# Altium project ETH_POE_SPI_RJ45.PrjPcb
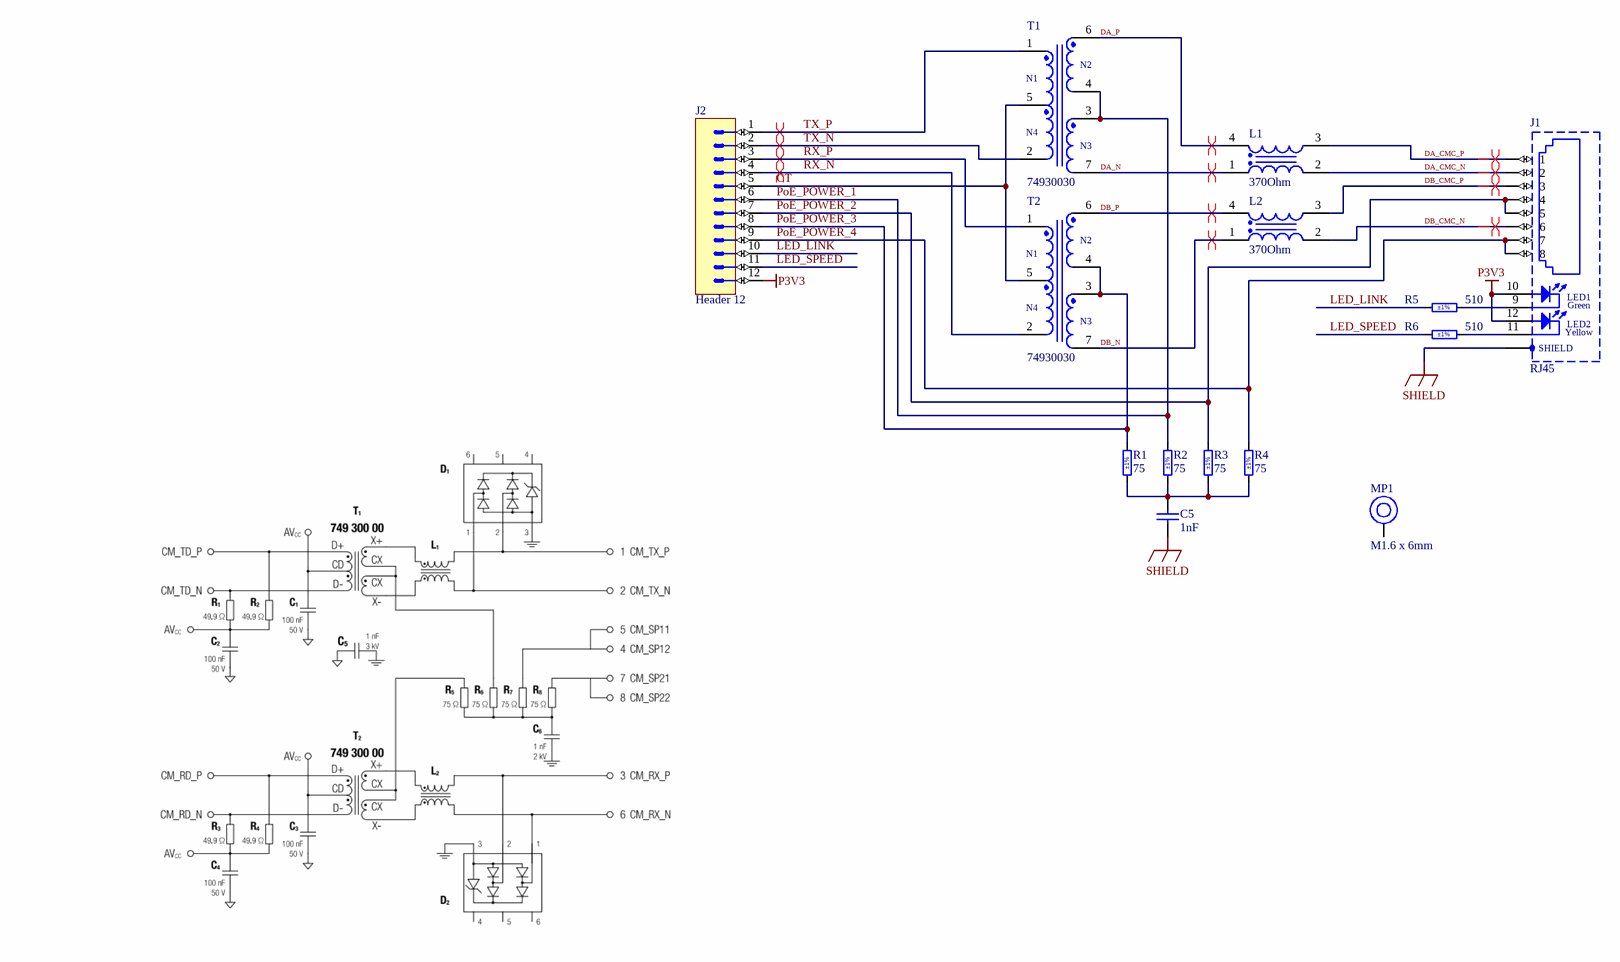
[diagram p0: ETH_POE_SPI_RJ45.SchDoc]
CreateDate: 11/12/2025; Revision: 1.0
1 sheet, 14 parts. Net scope: global (net labels, ports and power ports of the same name join across sheets).
Board file: ETH_POE_SPI_RJ45.PcbDoc

## Sheet ETH_POE_SPI_RJ45.SchDoc: ETH_POE_SPI_RJ45
size A3; Author: M.Beldyga; CompanyName: WUT ISE; DrawnBy: M.Beldyga; Organization: WUT ISE; Address1: PW ISE; Address2: Nowowiejska 15/19 00-665 Warsaw; Address3: micbeldyga@gmail.com; SheetNumber: 1; SheetTotal: 1; ModifiedBy: -; CheckedDate: -; Title2: MODULIQ; DivGrp: WUT ISE; Designer: M.Beldyga; ModifiedDate: -; ProjectName: Sensor Box

### Parts
C5  1nF  [CAPC3216X180N]
J1  RJ45  [AMPHENOL_RJHSE-3381]
J2  Header 12  [SAMTEC_HTSW-106-23-L-D]
L1  370Ohm  [WE-CNSW_0805]
L2  370Ohm  [WE-CNSW_0805]
MP1  M1.6 x 6mm  [97730606334]
R1  75  Tolerance: ±1%  [RESC1005X40N]
R2  75  Tolerance: ±1%  [RESC1005X40N]
R3  75  Tolerance: ±1%  [RESC1005X40N]
R4  75  Tolerance: ±1%  [RESC1005X40N]
R5  510  Tolerance: ±1%  [RESC1005X40N]
R6  510  Tolerance: ±1%  [RESC1005X40N]
T1  74930030  [74930030]
T2  74930030  [74930030]

### Nets
P3V3: J1.10(ALED1) J1.12(CLED2) J2.12
SHIELD: C5.1 J1.SHIELD
CT: J2.5 T1.5 T2.5
DA_CMC_N: J1.2 L1.2
DA_CMC_P: J1.1 L1.3
DA_N: L1.1 T1.7
DA_P: L1.4 T1.6
DB_CMC_N: J1.6 L2.2
DB_CMC_P: J1.3 L2.3
DB_N: L2.1 T2.7
DB_P: L2.4 T2.6
LED_LINK: J2.10 R5.1
LED_SPEED: J2.11 R6.1
PoE_POWER_1: J2.6 R2.2 T1.3 T1.4
PoE_POWER_2: J1.4 J1.5 J2.7 R3.2
PoE_POWER_3: J2.8 R1.2 T2.3 T2.4
PoE_POWER_4: J1.7 J1.8 J2.9 R4.2
RX_N: J2.4 T2.2
RX_P: J2.3 T2.1
TX_N: J2.2 T1.2
TX_P: J2.1 T1.1
NetC5_2: C5.2 R1.1 R2.1 R3.1 R4.1
NetJ1_9: J1.9(CLED1) R5.2
NetJ1_11: J1.11(ALED2) R6.2

Not connected (* = marked no-connect by the designer): MP1 1

### Layout directives
differential pair; net class D100: DA_CMC_N, DA_CMC_P, DA_N, DA_P, DB_CMC_N, DB_CMC_P, DB_N, DB_P, RX_N, RX_P, TX_N, TX_P

### Notes on the sheet
- Project/Equipment
- Document
- Designer
- Drawn by
- Check.by
- Contact
- File
- Last Mod.
- Print Date
- Sheet
- Size
- A3
- of
- Rev
- (in symbol 74930030) N2; N1; N4; N3
- (in symbol AMPHENOL_RJHSE-3381) LED1; Green; LED2; Yellow

### Library data of the parts
C5 = CC1206_1NF_2KV_10%_X7R: Non-polarised capacitor; Part Description: High Voltage MLC Chip Capacitor; Manufacturer: GENERIC; Manufacturer1 Part Number: 1206GC102KAT2A; Voltage: 2kV; TC: X7R; Tolerance: ±10%; Part Number: CC1206_1NF_2KV_10%_X7R; Component Kind: Standard; Component Type: Standard; Pin Count: 2; Value: 1nF; Status: None; Manufacturer Part Number: CC1206_1NF_2KV_10%_X7R; Case: 1206; Mounted: Yes; Socket: No; SMD: Yes; Sense: No; Manufacturer1 Example: AVX; Manufacturer1 ComponentHeight: 1.8mm; HelpURL: \\cern.ch\dfs\Applications\Altium\Datasheets\CC1206_X7R_AVX_HV-MLC.pdf; Author: CERN DEM JLC; CreateDate: 11/19/2012; LatestRevisionDate: 5/17/2017
J1 = AMPHENOL_RJHSE-3381: 1 Port, 8 Positions, CAT5 RJ45 Modular Connector With Yellow And Green LEDs; Part Description: 1 Port, 8 Positions, CAT5 RJ45 Modular Jack with Yellow and Green LEDs and Shield; PressFit: No; Part Number: AMPHENOL_RJHSE-3381; Component Kind: Standard; Component Type: Standard; Pin Count: 14; Family: RJ45; Mounted: Yes; Socket: No; SMD: No; Sense: No; Status: None; Manufacturer: AMPHENOL; Manufacturer Part Number: RJHSE-3381; ComponentHeight: 15.88mm; HelpURL: \\cern.ch\dfs\Applications\Altium\Datasheets\AMPHENOL_RJHSE-3381.pdf; ComponentLink1URL: \\cern.ch\dfs\Applications\Altium\Datasheets\AMPHENOL_RJHSE-3381_Package.pdf; ComponentLink1Description: Package Drawing; Author: CERN DEM JLC; CreateDate: 3/4/2019; LatestRevisionDate: 3/4/2019
J2 = SAMTEC_HTSW-106-23-L-D: Connector 12 Male; Part Description: 12 Contacts, Pitch 2.54mm, Dual Row Through Mount Straight Header (Post Lead 5.84mm, Tail Lead 2.92mm, Insulator 2.54mm); Manufacturer: SAMTEC; PressFit: No; Status Comment: High Temperature; Part Number: SAMTEC_HTSW-106-23-L-D; Component Kind: Standard; Component Type: Standard; Pin Count: 12; Family: Header 12; Mounted: Yes; Socket: No; SMD: No; Sense: No; Status: Preferred; Manufacturer Part Number: HTSW-106-23-L-D; ComponentHeight: 8.38mm; HelpURL: \\cern.ch\dfs\Applications\Altium\Datasheets\SAMTEC_HTSW-106-23-L-D.pdf; Author: CERN DEM JLC; CreateDate: 2/22/2018; LatestRevisionDate: 2/22/2018
L1 L2 = 744231371: WE-CNSW SMT Common Mode Line Filter, size 0805, 370Ohm, 0.478uH, 50V; Manufacturer: Wurth Elektronik; Case/Size Code: 0805; DC Resistance Max: 0.45Ohm; Insulation Test Voltage (AC): 125V; Rated Current: 0.28A; Winding Style: bifiliar; Manufacturer Part Number: 744231371; Category: Common Mode Chokes; Match Code: WE-CNSW; ComponentLink1Description: Website Link; ComponentLink1URL: https://www.we-online.com/redexpert/article/744231371?ad; ComponentLink2Description: Datasheet Link; ComponentLink2URL: https://www.we-online.com/redexpert/spec/744231371?ad; Mount: Surface Mount; Operating Temperature Max: 125°C; Operating Temperature Min: -40°C; Packaging: Tape and Reel; Length: 2mm; Width: 1.2mm; Height: 1.2mm; Impedance @100MHz: 370Ohm; Inductance: 0.478uH; Rated Voltage: 50V
MP1 = 97730606334R: WA-SMSI SMT Steel Spacer with internal Thread, OD 3.3mm, M1.6 x 6mm; Manufacturer: Wurth Elektronik; Inside Diameter: 1.9mm; Inside Thread Length: 2mm; Surface: Tin; Manufacturer Part Number: 97730606334R; Category: SMT Spacers; Match Code: WA-SMSI; ComponentLink1Description: Website Link; ComponentLink1URL: https://www.we-online.com/redexpert/article/97730606334R?ad; ComponentLink2Description: Datasheet Link; ComponentLink2URL: https://www.we-online.com/redexpert/spec/97730606334R?ad; Mount: Surface Mount; Operating Temperature Max: 150°C; Operating Temperature Min: -55°C; Packaging: Tape and Reel; Height: 6mm; Material: Steel; Outside Diameter: 3.3mm; Thread Size: M1.6
R1-R4 = R0402_75R_1%_0.0625W_100PPM: Resistor - 1%; Part Description: General Purpose Thick Film Chip Resistor; Manufacturer: GENERIC; Manufacturer1 Part Number: 232270677509L; TC: ±100ppm/°C; PressFit: No; Part Number: R0402_75R_1%_0.0625W_100PPM; Component Kind: Standard; Component Type: Standard; Pin Count: 2; Value: 75; Status: Not Recommended; Power: 0.0625W; Manufacturer Part Number: R0402_75R_1%_0.0625W_100PPM; Case: 0402; Mounted: Yes; Sense: No; Socket: No; SMD: Yes; Manufacturer1 Example: YAGEO PHYCOMP; Manufacturer1 ComponentHeight: 0.4mm; HelpURL: \\cern.ch\dfs\Applications\Altium\Datasheets\R0402_Phycomp_RC0402.pdf; Author: CERN DEM JLC; CreateDate: 12/3/2007; LatestRevisionDate: 10/17/2012
R5 R6 = R0402_510R_1%_0.0625W_100PPM: Resistor - 1%; Part Description: General Purpose Thick Film Chip Resistor; Manufacturer: GENERIC; Manufacturer1 Part Number: 232270675101L; TC: ±100ppm/°C; PressFit: No; Part Number: R0402_510R_1%_0.0625W_100PPM; Component Kind: Standard; Component Type: Standard; Pin Count: 2; Value: 510; Status: Not Recommended; Power: 0.0625W; Manufacturer Part Number: R0402_510R_1%_0.0625W_100PPM; Case: 0402; Mounted: Yes; Sense: No; Socket: No; SMD: Yes; Manufacturer1 Example: YAGEO PHYCOMP; Manufacturer1 ComponentHeight: 0.4mm; HelpURL: \\cern.ch\dfs\Applications\Altium\Datasheets\R0402_Phycomp_RC0402.pdf; Author: CERN DEM JLC; CreateDate: 12/3/2007; LatestRevisionDate: 10/17/2012
T1 T2 = 74930030: WE-STST SMT Super Tiny Signal Transformer, size 4532, 1:1, 350uH; Manufacturer: Wurth Elektronik; Case/Size Code: 4532; Data Rate: 10/100/1GBase-T; Insulation Test Voltage: 1500Vrms; Manufacturer Part Number: 74930030; Category: Signal Transformers; Match Code: WE-STST; ComponentLink1Description: Website Link; ComponentLink1URL: https://www.we-online.com/redexpert/article/74930030?ad; ComponentLink2Description: Datasheet Link; ComponentLink2URL: https://www.we-online.com/redexpert/spec/74930030?ad; Mount: Surface Mount; Operating Temperature Max: 105°C; Operating Temperature Min: -40°C; Packaging: Tape and Reel; Length: 4.7mm; Width: 3.22mm; Height: 2.9mm; Application: Ethernet, PoE; Inductance: 350uH; Turns Ratio: 1:1